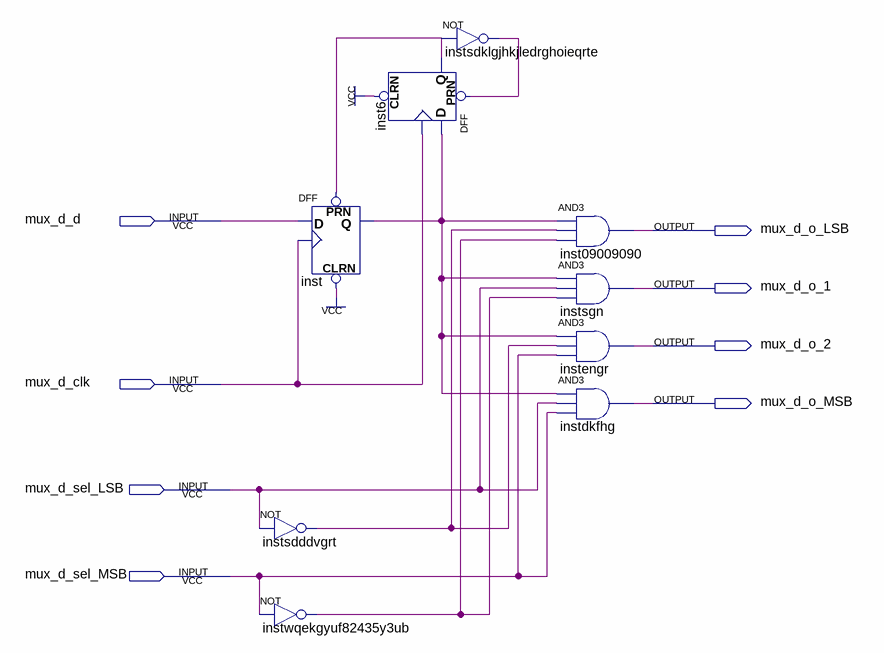
[diagram p0: schematic sheet]
// Quartus schematic loader.bdf as structural Verilog: 9 symbols, 8 pins
module loader (
  input  mux_d_d,
  input  mux_d_clk,
  input  mux_d_sel_LSB,
  input  mux_d_sel_MSB,
  output mux_d_o_LSB,
  output mux_d_o_1,
  output mux_d_o_2,
  output mux_d_o_MSB
);

  wire inst6_q, inst_q, instsdddvgrt_out, instsdklgjhkjledrghoieqrte_out, instwqekgyuf82435y3ub_out;

  not instsdddvgrt (instsdddvgrt_out, mux_d_sel_LSB);
  not instwqekgyuf82435y3ub (instwqekgyuf82435y3ub_out, mux_d_sel_MSB);
  DFF inst (.CLRN(1'b1), .CLK(mux_d_clk), .D(mux_d_d), .PRN(inst6_q), .Q(inst_q));
  DFF inst6 (.CLRN(1'b1), .CLK(mux_d_clk), .D(inst_q), .PRN(instsdklgjhkjledrghoieqrte_out), .Q(inst6_q));
  not instsdklgjhkjledrghoieqrte (instsdklgjhkjledrghoieqrte_out, inst6_q);
  and inst09009090 (mux_d_o_LSB, inst_q, instsdddvgrt_out, instwqekgyuf82435y3ub_out);
  and instsgn (mux_d_o_1, inst_q, mux_d_sel_LSB, instwqekgyuf82435y3ub_out);
  and instengr (mux_d_o_2, inst_q, instsdddvgrt_out, mux_d_sel_MSB);
  and instdkfhg (mux_d_o_MSB, inst_q, mux_d_sel_LSB, mux_d_sel_MSB);
endmodule
